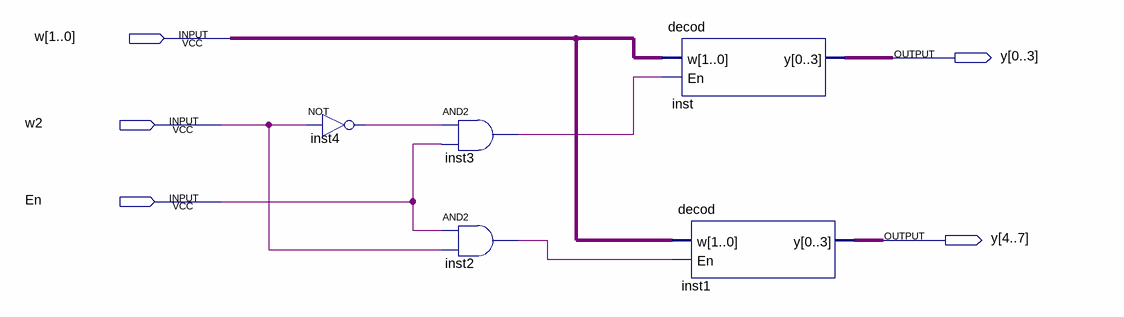
[diagram p0: schematic sheet]
// Quartus schematic decodeModified.bdf as structural Verilog: 5 symbols, 5 pins
module decodeModified (
  input  [1:0] w,
  input  w2,
  input  En,
  output [0:7] y
);

  wire inst2_out, inst3_out, inst4_out;

  not inst4 (inst4_out, w2);
  and inst3 (inst3_out, inst4_out, En);
  and inst2 (inst2_out, En, w2);
  decod inst (.w(w), .En(inst3_out), .y(y[0:3]));
  decod inst1 (.w(w), .En(inst2_out), .y(y[4:7]));
endmodule
